# EAGLE design atari2600 (EAGLE 7.7.0)
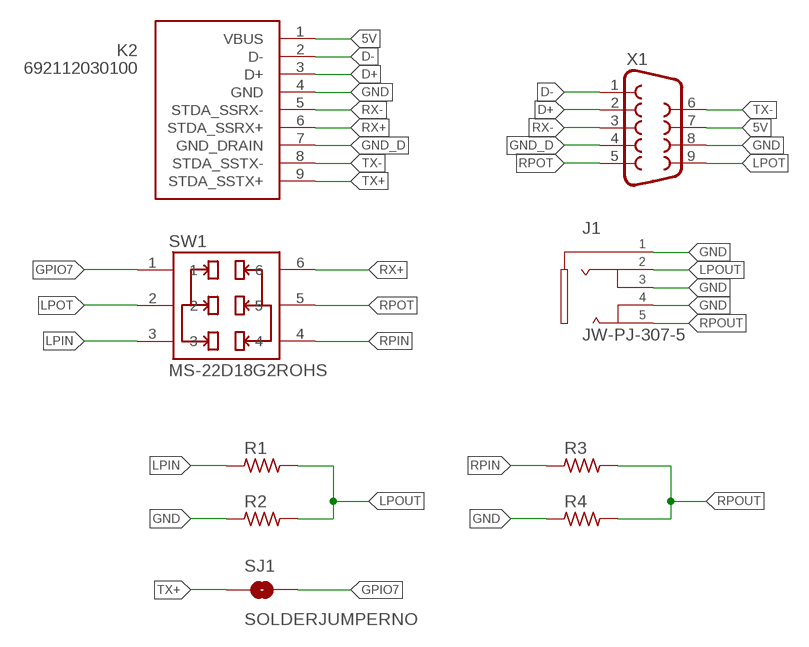
[diagram p0: schematic, sheet 1]

## Parts
J1  JW-PJ-307-5  [JW-PJ-307-X]
K2  692112030100  [692112030100]
R1  R_0603  [R0603]
R2  R_0603  [R0603]
R3  R_0603  [R0603]
R4  R_0603  [R0603]
SJ1  SOLDERJUMPERNO  [SJ_2S-NO]
SW1  MS-22D18G2ROHS  [SW_MS-22D18G2ROHS]
X1  DB9MALE  [DB9_MALE]

## Nets
5V: K2.1(VBUS) X1.7
D+: K2.3(D+) X1.2
D-: K2.2(D-) X1.1
GND: J1.P$1 J1.P$3 J1.P$4 K2.4(GND) R2.1 R4.1 X1.8
GND_D: K2.7(GND_DRAIN) X1.4
GPIO7: SJ1.2 SW1.1
LPIN: R1.1 SW1.3
LPOT: SW1.2 X1.9
LPOUT: J1.P$2 R1.2 R2.2
RPIN: R3.1 SW1.4
RPOT: SW1.5 X1.5
RPOUT: J1.P$5 R3.2 R4.2
RX+: K2.6(STDA_SSRX+) SW1.6
RX-: K2.5(STDA_SSRX-) X1.3
TX+: K2.9(STDA_SSTX+) SJ1.1
TX-: K2.8(STDA_SSTX-) X1.6

## Library data of the parts
J1 = audioconn:JW-PJ-307-5
K2 = Wuerth_Elektronik_eiCan_Communication_Connectors_STENCIL:692112030100: WR-COM USB 3.0 SMT PLUG WITH CLIPTYPE A
R1-R4 = rc-master-smd:R_: RESISTOR
SJ1 = SparkFun:SOLDERJUMPER: Solder Jumper Standard SMD solder jumper. Used to automate production. Two varients : Normally Open and Normally Closed are the same, but have different paste layers. NC will have a large amount of paste and should jumper during reflow.
SW1 = MS-22D18G2ROHS:MS-22D18G2ROHS: 9 mm DPDT Switch (Slide); AVAILABILITY: Unavailable; MF: Deyilong; MP: MS-22D18 G2 ROHS; PACKAGE: None; PRICE: None
X1 = SparkFun:DB9: DB9 Connector Standard DB9 (D-Sub 9) serial connector. Can be used for CAN bus as well as RS485 and RS232. Footprint production proven. Spark Fun Electronics SKU : PRT-00429

## Board
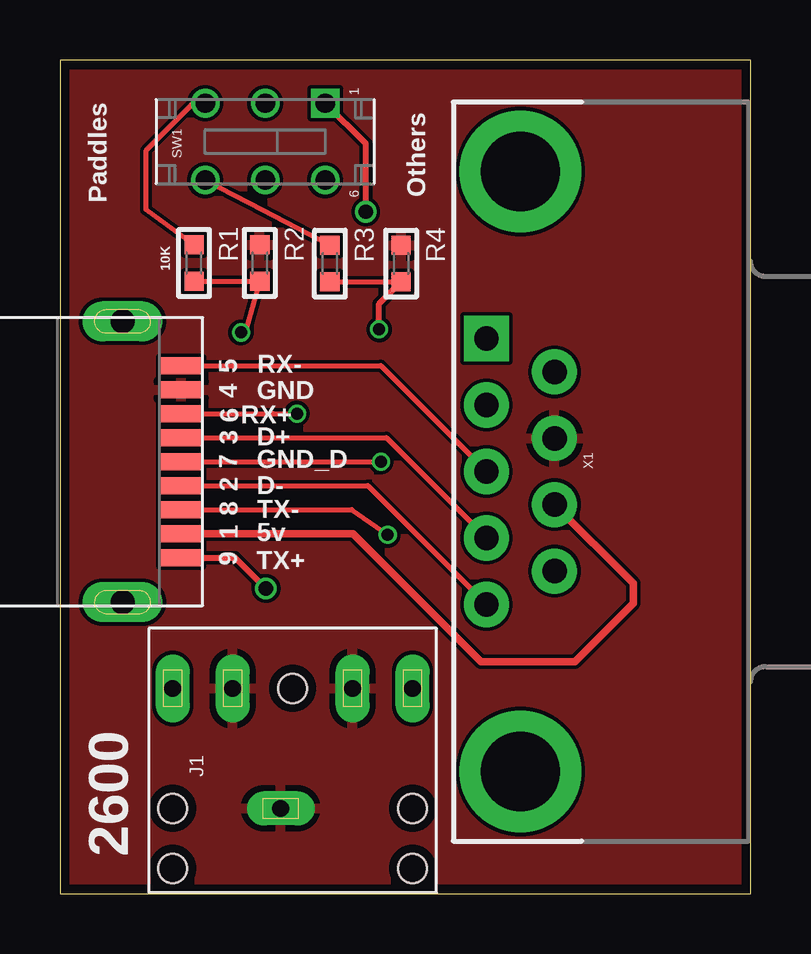
[diagram p1: board, top side]
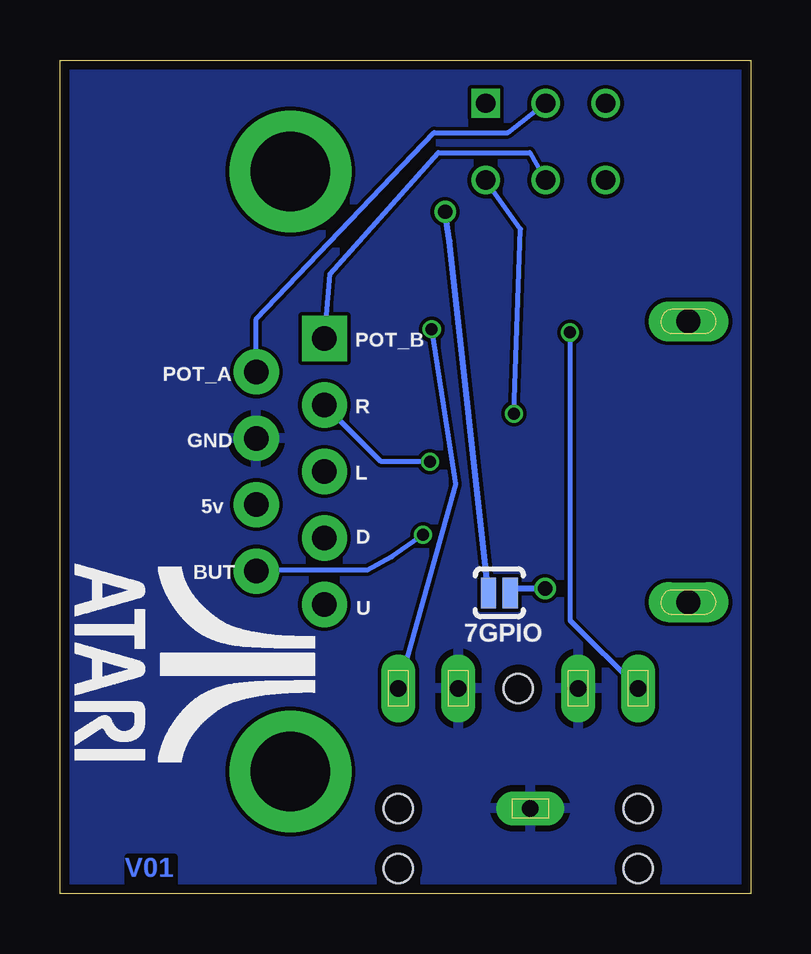
[diagram p2: board, bottom side, seen from below]

Size 28.81 x 34.75 mm. Coordinates in mm from the lower left corner, seen from the top.
Outline: 0,0 28.81,0 28.81,34.75 0,34.75 0,0
Copper layers (1*16): Top 0.035559375mm / dielectric 1.6mm / Bottom 0.035559375mm
Design rules "oshpark-2layer": minimum track width 6mil, minimum drill 10mil, track to track 6mil, track to pad 6mil, pad to pad 6mil, via to via 6mil, smd to smd 6mil, copper to edge 15mil, drill to drill 6mil, minimum pad ring 5mil, minimum via ring 5mil, stop-mask expansion 2.5mil, vias tented up to drill 0mil, thermal gap 10mil

### Footprints (pad centres in the part's own frame; a part is rotated, then mirrored left to right if it is on the bottom)
JW-PJ-307-X = drill 0.7 pad 1.422 long: P$1 -2,0.5; P$2 3,5; P$3 3,2.5; P$4 3,-2.5; P$5 3,-5 | hole 1.2: -4.5,5; -2,5; 3,0; -4.5,-5; -2,-5
692112030100 = smd 0.7 x 1.8: 1 -3,0; 2 -1,0; 3 1,0; 4 3,0; 5 4,0; 6 2,0; 7 0,0; 8 -2,0; 9 -4,0 | drill 1 pad 1.676 long: Z1 5.85,2.45; Z2 -5.85,2.45
R0603 = smd 0.8 x 0.8: 1 -0.762,0; 2 0.762,0
SJ_2S-NO = smd 0.635 x 1.27: 1 -0.45,0; 2 0.45,0
SW_MS-22D18G2ROHS = drill 0.8 square: 1 -1.6,2.5 | drill 0.8: 2 -1.6,0; 3 -1.6,-2.5; 4 1.6,-2.5; 5 1.6,0; 6 1.6,2.5
DB9_MALE = drill 1.016 pad 1.88: 1 5.54,-1.42; 2 2.77,-1.42; 3 0,-1.42; 4 -2.77,-1.42; 6 4.15,1.42; 7 1.38,1.42; 8 -1.38,1.42; 9 -4.15,1.42 | drill 1.016 pad 1.88 square: 5 -5.54,-1.42 | drill 3.302 pad 5.08: G1 -12.5,0; G2 12.5,0

### Placement (x,y rotation side)
J1  9.7,5.56 90 top
K2  5.05,18.01 90 top
R1  5.59,26.29 270 top
R2  8.33,26.29 270 top
R3  11.25,26.26 270 top
R4  14.22,26.26 270 top
SJ1  10.49,12.55 180 bottom
SW1  8.56,31.34 270 top
X1  19.2,17.6 270 top

### Tracks (layer width: path | path; a pad name or v marks a point on that pad's centre or on a via)
5V
  Top 0.305: K2.1 12.22,15.01 17.55,9.68 21.46,9.68 23.9,12.12 23.9,12.94 X1.7
D+
  Top 0.203: K2.3 13.61,19.01 X1.2
D-
  Top 0.203: K2.2 12.84,17.01 X1.1
GND
  pour Bottom: 0.23,34.59 28.6,34.7 28.75,0.03 0.15,0.13
  pour Top: 0.25,34.57 28.65,34.7 28.73,0.1 0.15,0.13
GND_D  (via drill 0.5 pad 0.2)
  Top 0.203: K2.7 v13.39,18.01
  Bottom 0.203: v13.39,18.01 15.42,18.01 X1.4
GPIO7  (via drill 0.6)
  Top 0.254: v12.75,28.42 12.75,31.25 SW1.1
  Bottom 0.254: SJ1.2 12.57,27.2 v12.75,28.42
LPIN
  Top 0.203: SW1.3 5.56,32.94 3.58,30.96 3.58,28.52 R1.1
LPOT
  Bottom 0.203: X1.9 20.62,23.95 13.21,31.72 10.13,31.72 SW1.2
LPOUT  (via drill 0.5 pad 0.2)
  Top 0.203: R1.2 R2.2 7.77,23.62 v7.54,23.39
  Bottom 0.203: v7.54,23.39 7.54,11.4 J1.P$2
RPIN
  Top 0.203: SW1.4 8.47,28.48 R3.1
RPOT
  Bottom 0.203: X1.5 17.55,25.83 13.03,30.89 9.22,30.89 SW1.5
RPOUT  (via drill 0.5 pad 0.2)
  Top 0.203: R3.2 R4.2
  Top 0.254: v13.31,23.52 13.31,24.59 R4.2
  Bottom 0.203: v13.31,23.52 12.32,17.07 J1.P$5
RX+  (via drill 0.5 pad 0.2)
  Top 0.203: K2.6 8.9,20.01 v9.88,20.02
  Bottom 0.203: v9.88,20.02 9.6,27.7 SW1.6
RX-
  Top 0.203: K2.5 13.38,22.01 X1.3
TX+  (via drill 0.6)
  Top 0.254: K2.9 7.3,14.01 v8.59,12.73
  Bottom 0.254: v8.59,12.73 9.86,12.73 SJ1.1
TX-  (via drill 0.5 pad 0.2)
  Top 0.203: K2.8 12.16,16.01 v13.67,14.96
  Bottom 0.203: v13.67,14.96 14.99,14.05 16,13.49 20.59,13.49 X1.6

### Text on the board
Bottom: V01
tPlace: Paddles | Others | 10K | 5 | RX- | 4 | GND | 6 | 3 | RX+ | D+ | 7 | GND_D | 2 | D- | 8 | TX- | 1 | 5v | 9 | TX+ | 2600
bPlace: POT_B | POT_A | R | GND | L | 5v | D | BUT | U | 7GPIO